# Altium project Kalibracija.PrjPcb
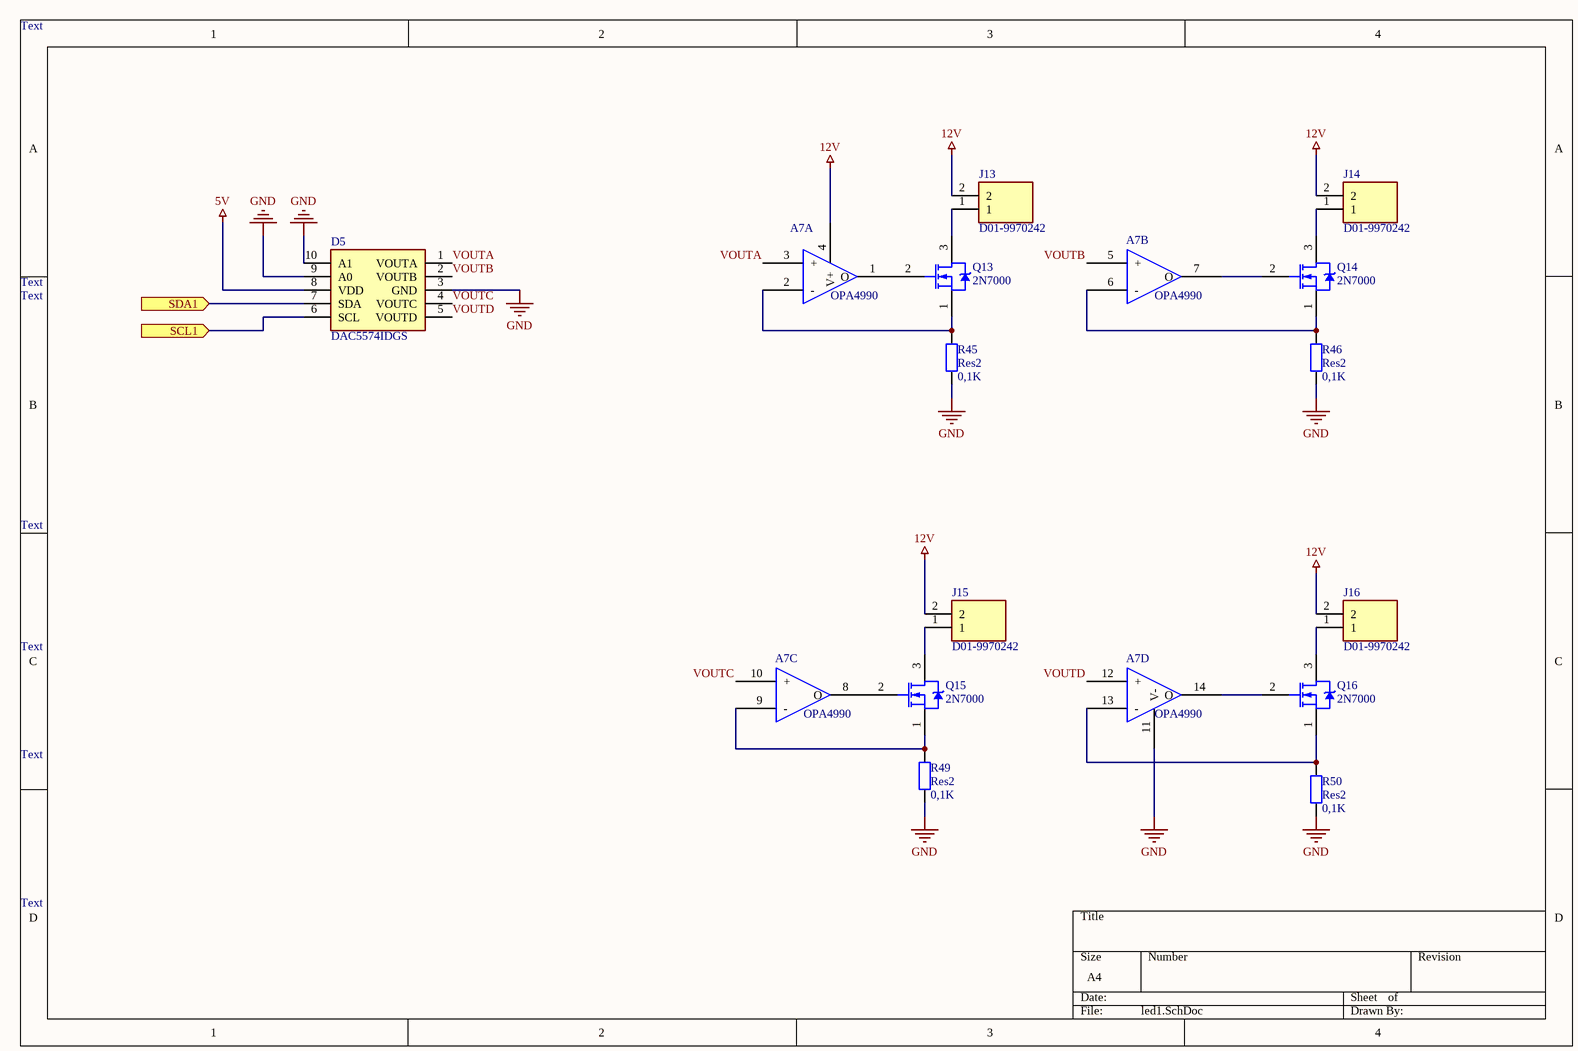
[diagram p0: led1.SchDoc]
8 sheets, 126 parts. Net scope: flat (ports and power ports of the same name join across sheets).
Board file: Plocica_kalibrator.PcbDoc
Sheets:
  led1.SchDoc
  led2.SchDoc
  led3.SchDoc
  led4.SchDoc
  led5.SchDoc
  mikrokontroler.SchDoc
  power.SchDoc
  blokadni_kondenzatori.SchDoc

## Sheet led1.SchDoc
size A4; DocumentNumber: 1; SheetNumber: 1; SheetTotal: 8

### Parts
A7  OPA4990  [SOIC127P600X175-14N]  (parts A,B,C,D of 4)
D5  DAC5574IDGS  [SOP50P490X110-10N]
J13  D01-9970242  [HDR1X2]
J14  D01-9970242  [HDR1X2]
J15  D01-9970242  [HDR1X2]
J16  D01-9970242  [HDR1X2]
Q13  2N7000  [ONSC-TO-92-3-29-11]
Q14  2N7000  [ONSC-TO-92-3-29-11]
Q15  2N7000  [ONSC-TO-92-3-29-11]
Q16  2N7000  [ONSC-TO-92-3-29-11]
R45  Res2  value 0,1K  [C1210]
R46  Res2  value 0,1K  [C1210]
R49  Res2  value 0,1K  [C1210]
R50  Res2  value 0,1K  [C1210]

### Ports
SCL1 (in), SDA1 (in)

### Nets
5V: D5.8(VDD)
12V: A7.4(V+) J13.2 J14.2 J15.2 J16.2
GND: A7.11(V-) D5.3(GND) D5.9(A0) D5.10(A1) R45.1 R46.1 R49.2 R50.2
PB6: D5.6(SCL) ; port SCL1
PB7: D5.7(SDA) ; port SDA1
VOUTA: A7.3(+) D5.1(VOUTA)  [project net VOUTA_1]
VOUTB: A7.5(+) D5.2(VOUTB)  [project net VOUTB_1]
VOUTC: A7.10(+) D5.4(VOUTC)  [project net VOUTC_1]
VOUTD: A7.12(+) D5.5(VOUTD)  [project net VOUTD_1]
NetA7_1: A7.1(O) Q13.2(G)
NetA7_2: A7.2(-) Q13.1(S) R45.2
NetA7_6: A7.6(-) Q14.1(S) R46.2
NetA7_7: A7.7(O) Q14.2(G)
NetA7_8: A7.8(O) Q15.2(G)
NetA7_9: A7.9(-) Q15.1(S) R49.1
NetA7_13: A7.13(-) Q16.1(S) R50.1
NetA7_14: A7.14(O) Q16.2(G)
NetJ13_1: J13.1 Q13.3(D)
NetJ14_1: J14.1 Q14.3(D)
NetJ15_1: J15.1 Q15.3(D)
NetJ16_1: J16.1 Q16.3(D)

### Notes on the sheet
- Text

### Library data of the parts
D5 = DAC5574IDGS: Integrated Circuit; Manufacturer_Name: Texas Instruments; Datasheet Link: http://www.ti.com/lit/gpn/dac5574; Height: 1.1mm; Manufacturer_Part_Number: DAC5574IDGS; Mouser Part Number: 595-DAC5574IDGS; Mouser Price/Stock: https://www.mouser.com/Search/Refine.aspx?Keyword=595-DAC5574IDGS; RS Part Number: 6621533P; RS Price/Stock: http://uk.rs-online.com/web/p/products/6621533P
J13-J16 = D01-9970242: Connector; Manufacturer_Name: HARWIN; Datasheet Link: https://componentsearchengine.com/Datasheets/1/D01-9970242.pdf; Height: 4.25mm; Manufacturer_Part_Number: D01-9970242; Mouser Part Number: 855-D01-9970242; Mouser Price/Stock: https://www.mouser.com/Search/Refine.aspx?Keyword=855-D01-9970242
Q13-Q16 = CMP-1058-00936-1: Small Signal MOSFET, 200 mA, 60 V, N-Channel, 3-Pin TO-92, Bulk Box; Manufacturer: On Semiconductor; Ciss Typ (pF): 60; VGS(th) Max (V): 3; Crss Typ (pF): 5; Channel Polarity: N Channel; VGS Max (V): 20; Configuration: Single; PD Max (W): 0.35; Coss Typ (pF): 25; ID Max (A): 0.2; PackageVersion: Rev. AM; ComponentLink3URL: http://www.onsemi.cn/pub_link/Collateral/2N6426-D.PDF; ComponentLink2URL: http://www.onsemi.com/pub_link/Collateral/2N7000-D.PDF; DatasheetVersion: Rev. 8; Mounting Technology: Through Hole; V(BR)DSS Min (V): 60; PartNumber: 2N7000; PackageDescription: 3-Pin Transistor Outline, Body 4.825 x 3.685 mm, Pitch 1.27 mm; ComponentLink2Description: Datasheet; ComponentLink1URL: http://www.onsemi.com/; PackageReference: TO-92-3-29-11_AM_SL; Packing: Bulk Box; ComponentLink1Description: Manufacturer URL; Package Type: TO-92; ComponentLink3Description: Package Specification
R45 R46 R49 R50 = Res2: Resistor; Published: 8-Jun-2000; LatestRevisionDate: 17-Jul-2002; LatestRevisionNote: Re-released for DXP Platform.; PackageReference: AXIAL-0.4; Publisher: Altium Limited; PackageDescription: Axial Device, Thru-Hole; 2 Leads; 0.4 in Pin Spacing

## Sheet led2.SchDoc
size A4; DocumentNumber: 2; SheetNumber: 2; SheetTotal: 8
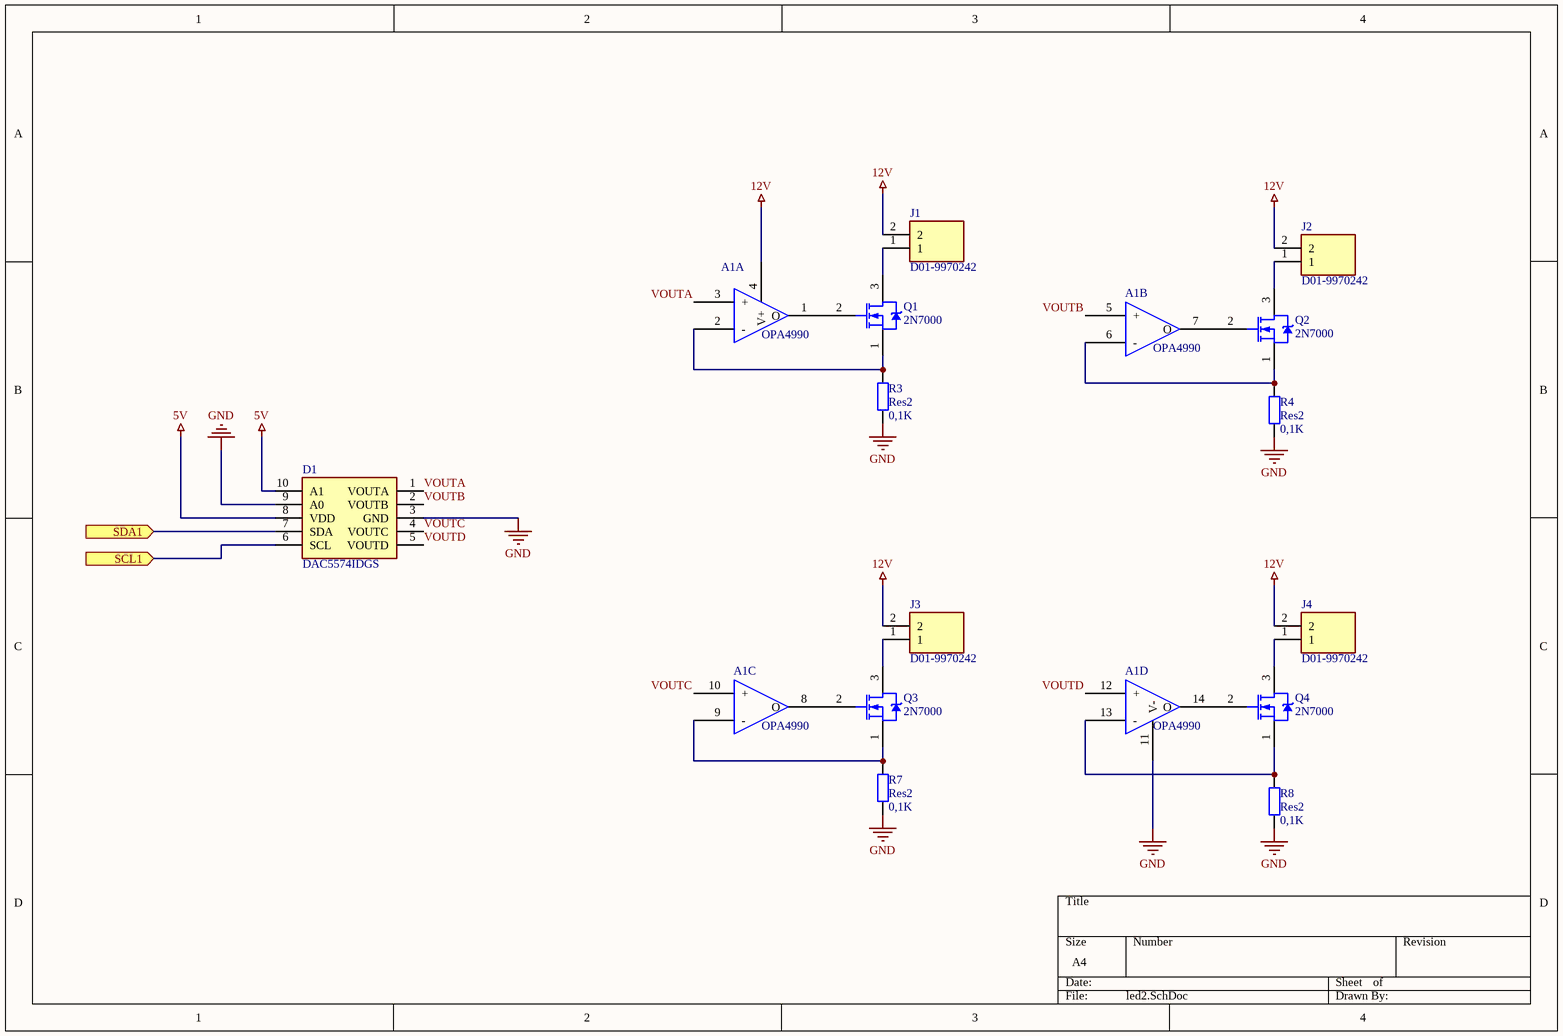
[diagram p1: led2.SchDoc]

### Parts
A1  OPA4990  [SOIC127P600X175-14N]  (parts A,B,C,D of 4)
D1  DAC5574IDGS  [SOP50P490X110-10N]
J1  D01-9970242  [HDR1X2]
J2  D01-9970242  [HDR1X2]
J3  D01-9970242  [HDR1X2]
J4  D01-9970242  [HDR1X2]
Q1  2N7000  [ONSC-TO-92-3-29-11]
Q2  2N7000  [ONSC-TO-92-3-29-11]
Q3  2N7000  [ONSC-TO-92-3-29-11]
Q4  2N7000  [ONSC-TO-92-3-29-11]
R3  Res2  value 0,1K  [C1210]
R4  Res2  value 0,1K  [C1210]
R7  Res2  value 0,1K  [C1210]
R8  Res2  value 0,1K  [C1210]

### Ports
SCL1 (in), SDA1 (in)

### Nets
5V: D1.8(VDD) D1.10(A1)
12V: A1.4(V+) J1.2 J2.2 J3.2 J4.2
GND: A1.11(V-) D1.3(GND) D1.9(A0) R3.1 R4.1 R7.1 R8.1
PB6: D1.6(SCL) ; port SCL1
PB7: D1.7(SDA) ; port SDA1
VOUTA: A1.3(+) D1.1(VOUTA)  [project net VOUTA_2]
VOUTB: A1.5(+) D1.2(VOUTB)  [project net VOUTB_2]
VOUTC: A1.10(+) D1.4(VOUTC)  [project net VOUTC_2]
VOUTD: A1.12(+) D1.5(VOUTD)  [project net VOUTD_2]
NetA1_1: A1.1(O) Q1.2(G)
NetA1_2: A1.2(-) Q1.1(S) R3.2
NetA1_6: A1.6(-) Q2.1(S) R4.2
NetA1_7: A1.7(O) Q2.2(G)
NetA1_8: A1.8(O) Q3.2(G)
NetA1_9: A1.9(-) Q3.1(S) R7.2
NetA1_13: A1.13(-) Q4.1(S) R8.2
NetA1_14: A1.14(O) Q4.2(G)
NetJ1_1: J1.1 Q1.3(D)
NetJ2_1: J2.1 Q2.3(D)
NetJ3_1: J3.1 Q3.3(D)
NetJ4_1: J4.1 Q4.3(D)

### Library data of the parts
D1 = DAC5574IDGS: as D5 on sheet led1; Datasheet Link: http://www.ti.com/lit/gpn/dac5574; Height: 1.1mm; Manufacturer_Part_Number: DAC5574IDGS; Mouser Part Number: 595-DAC5574IDGS; Mouser Price/Stock: https://www.mouser.com/Search/Refine.aspx?Keyword=595-DAC5574IDGS; RS Part Number: 6621533P; RS Price/Stock: http://uk.rs-online.com/web/p/products/6621533P
J1-J4 = D01-9970242: Connector; Manufacturer_Name: HARWIN; Datasheet Link: https://componentsearchengine.com/Datasheets/1/D01-9970242.pdf; Height: 4.25mm; Manufacturer_Part_Number: D01-9970242; Mouser Part Number: 855-D01-9970242; Mouser Price/Stock: https://www.mouser.com/Search/Refine.aspx?Keyword=855-D01-9970242
Q1-Q4 = CMP-1058-00936-1: as Q13 on sheet led1; PackageVersion: Rev. AM; ComponentLink3URL: http://www.onsemi.cn/pub_link/Collateral/2N6426-D.PDF; ComponentLink2URL: http://www.onsemi.com/pub_link/Collateral/2N7000-D.PDF; DatasheetVersion: Rev. 8; Mounting Technology: Through Hole; V(BR)DSS Min (V): 60; PartNumber: 2N7000; PackageDescription: 3-Pin Transistor Outline, Body 4.825 x 3.685 mm, Pitch 1.27 mm; ComponentLink2Description: Datasheet; ComponentLink1URL: http://www.onsemi.com/; PackageReference: TO-92-3-29-11_AM_SL; Packing: Bulk Box; ComponentLink1Description: Manufacturer URL; Package Type: TO-92; ComponentLink3Description: Package Specification
R3 R4 R7 R8 = Res2: Resistor; Published: 8-Jun-2000; LatestRevisionDate: 17-Jul-2002; LatestRevisionNote: Re-released for DXP Platform.; PackageReference: AXIAL-0.4; Publisher: Altium Limited; PackageDescription: Axial Device, Thru-Hole; 2 Leads; 0.4 in Pin Spacing

## Sheet led3.SchDoc
size A4; DocumentNumber: 3; SheetNumber: 3; SheetTotal: 8
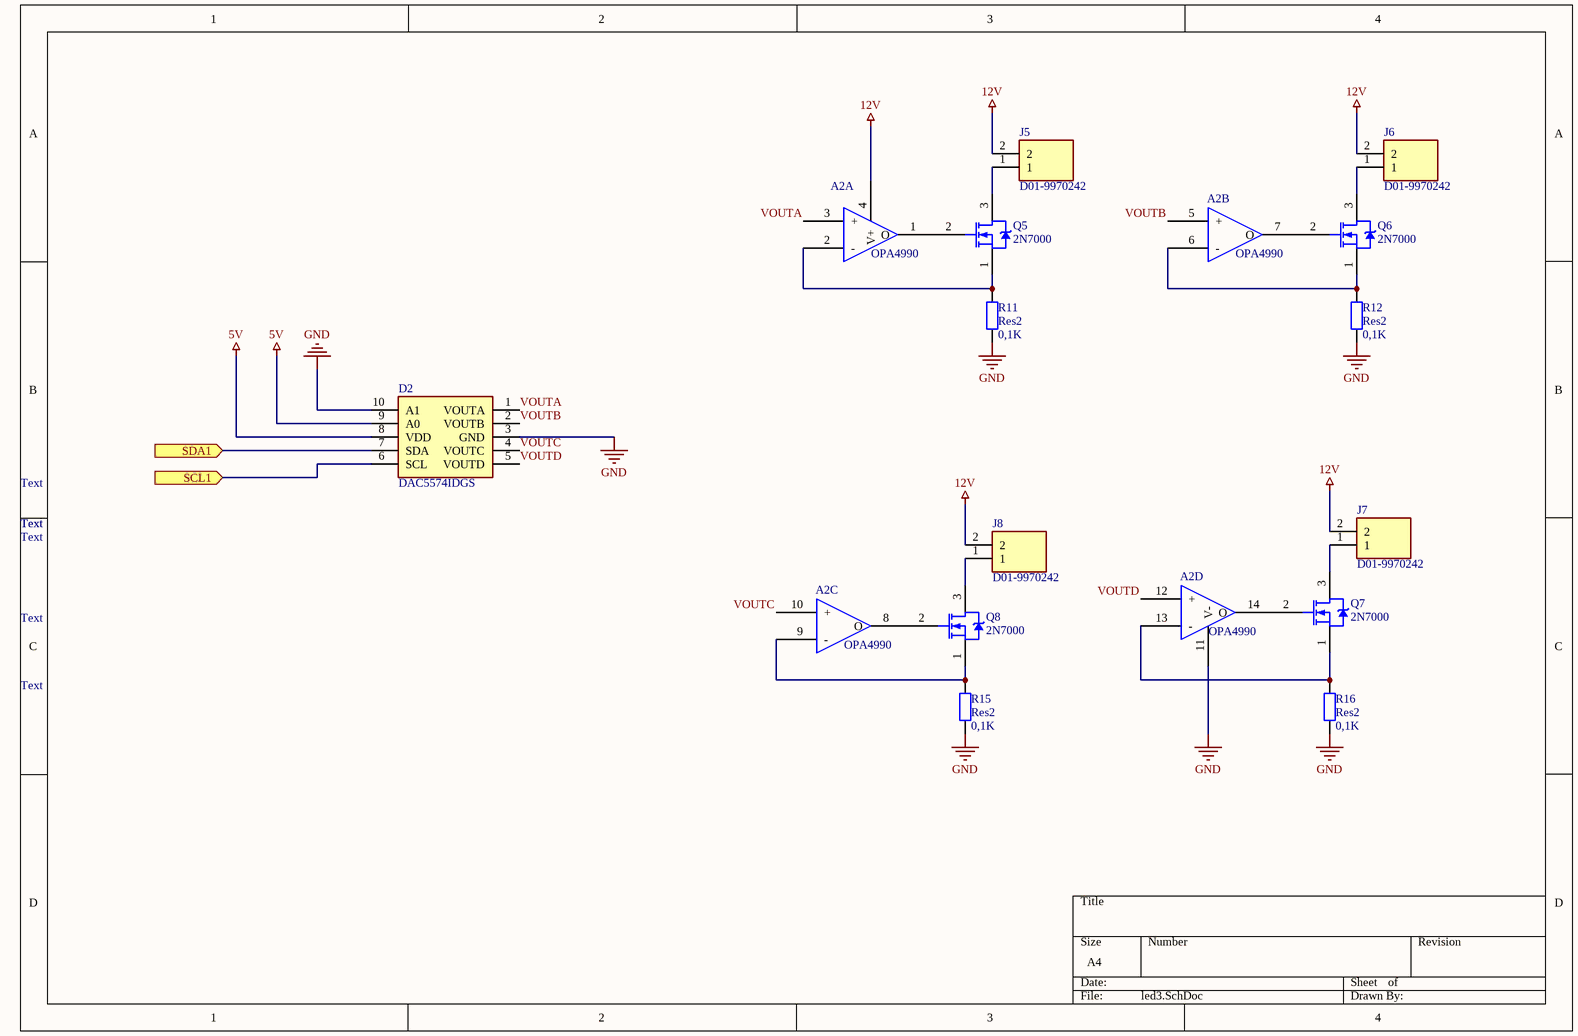
[diagram p2: led3.SchDoc]

### Parts
A2  OPA4990  [SOIC127P600X175-14N]  (parts A,B,C,D of 4)
D2  DAC5574IDGS  [SOP50P490X110-10N]
J5  D01-9970242  [HDR1X2]
J6  D01-9970242  [HDR1X2]
J7  D01-9970242  [HDR1X2]
J8  D01-9970242  [HDR1X2]
Q5  2N7000  [ONSC-TO-92-3-29-11]
Q6  2N7000  [ONSC-TO-92-3-29-11]
Q7  2N7000  [ONSC-TO-92-3-29-11]
Q8  2N7000  [ONSC-TO-92-3-29-11]
R11  Res2  value 0,1K  [C1210]
R12  Res2  value 0,1K  [C1210]
R15  Res2  value 0,1K  [C1210]
R16  Res2  value 0,1K  [C1210]

### Ports
SCL1 (in), SDA1 (in)

### Nets
5V: D2.8(VDD) D2.9(A0)
12V: A2.4(V+) J5.2 J6.2 J7.2 J8.2
GND: A2.11(V-) D2.3(GND) D2.10(A1) R11.1 R12.1 R15.1 R16.1
PB6: D2.6(SCL) ; port SCL1
PB7: D2.7(SDA) ; port SDA1
VOUTA: A2.3(+) D2.1(VOUTA)  [project net VOUTA_3]
VOUTB: A2.5(+) D2.2(VOUTB)  [project net VOUTB_3]
VOUTC: A2.10(+) D2.4(VOUTC)  [project net VOUTC_3]
VOUTD: A2.12(+) D2.5(VOUTD)  [project net VOUTD_3]
NetA2_1: A2.1(O) Q5.2(G)
NetA2_2: A2.2(-) Q5.1(S) R11.2
NetA2_6: A2.6(-) Q6.1(S) R12.2
NetA2_7: A2.7(O) Q6.2(G)
NetA2_8: A2.8(O) Q8.2(G)
NetA2_9: A2.9(-) Q8.1(S) R15.2
NetA2_13: A2.13(-) Q7.1(S) R16.2
NetA2_14: A2.14(O) Q7.2(G)
NetJ5_1: J5.1 Q5.3(D)
NetJ6_1: J6.1 Q6.3(D)
NetJ7_1: J7.1 Q7.3(D)
NetJ8_1: J8.1 Q8.3(D)

### Notes on the sheet
- Text

### Library data of the parts
D2 = DAC5574IDGS: as D5 on sheet led1; Datasheet Link: http://www.ti.com/lit/gpn/dac5574; Height: 1.1mm; Manufacturer_Part_Number: DAC5574IDGS; Mouser Part Number: 595-DAC5574IDGS; Mouser Price/Stock: https://www.mouser.com/Search/Refine.aspx?Keyword=595-DAC5574IDGS; RS Part Number: 6621533P; RS Price/Stock: http://uk.rs-online.com/web/p/products/6621533P
J5-J8 = D01-9970242: Connector; Manufacturer_Name: HARWIN; Datasheet Link: https://componentsearchengine.com/Datasheets/1/D01-9970242.pdf; Height: 4.25mm; Manufacturer_Part_Number: D01-9970242; Mouser Part Number: 855-D01-9970242; Mouser Price/Stock: https://www.mouser.com/Search/Refine.aspx?Keyword=855-D01-9970242
Q5-Q8 = CMP-1058-00936-1: as Q13 on sheet led1; PackageVersion: Rev. AM; ComponentLink3URL: http://www.onsemi.cn/pub_link/Collateral/2N6426-D.PDF; ComponentLink2URL: http://www.onsemi.com/pub_link/Collateral/2N7000-D.PDF; DatasheetVersion: Rev. 8; Mounting Technology: Through Hole; V(BR)DSS Min (V): 60; PartNumber: 2N7000; PackageDescription: 3-Pin Transistor Outline, Body 4.825 x 3.685 mm, Pitch 1.27 mm; ComponentLink2Description: Datasheet; ComponentLink1URL: http://www.onsemi.com/; PackageReference: TO-92-3-29-11_AM_SL; Packing: Bulk Box; ComponentLink1Description: Manufacturer URL; Package Type: TO-92; ComponentLink3Description: Package Specification
R11 R12 R15 R16 = Res2: Resistor; Published: 8-Jun-2000; LatestRevisionDate: 17-Jul-2002; LatestRevisionNote: Re-released for DXP Platform.; PackageReference: AXIAL-0.4; Publisher: Altium Limited; PackageDescription: Axial Device, Thru-Hole; 2 Leads; 0.4 in Pin Spacing

## Sheet led4.SchDoc
size A4; DocumentNumber: 4; SheetNumber: 4; SheetTotal: 8
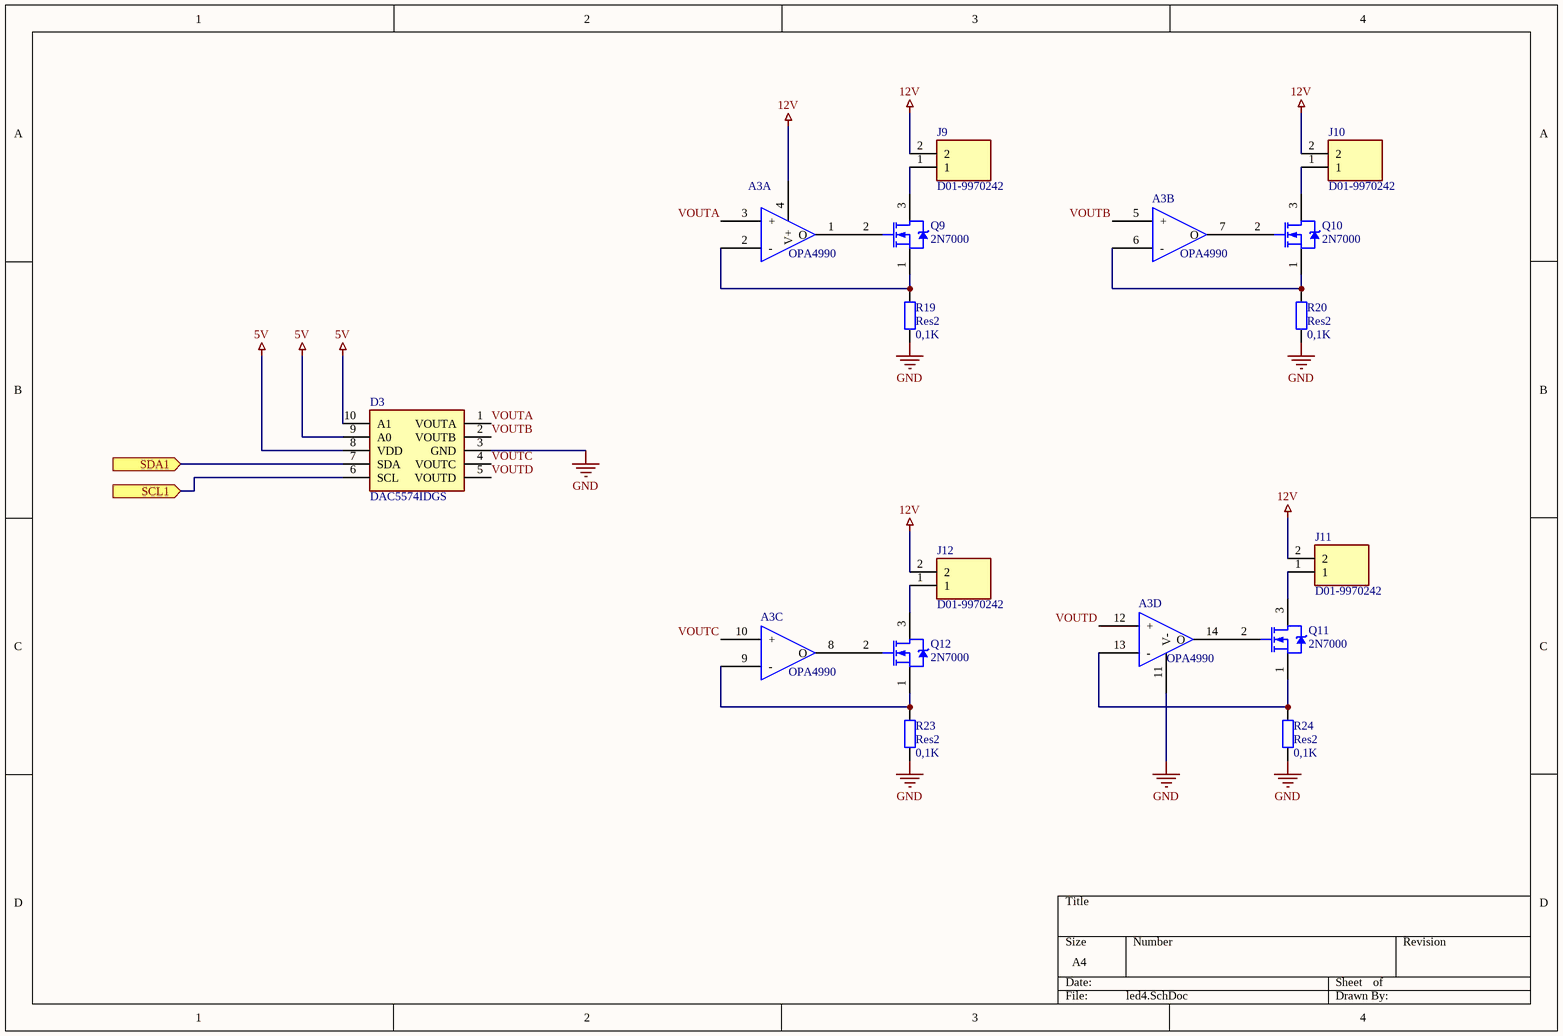
[diagram p3: led4.SchDoc]

### Parts
A3  OPA4990  [SOIC127P600X175-14N]  (parts A,B,C,D of 4)
D3  DAC5574IDGS  [SOP50P490X110-10N]
J9  D01-9970242  [HDR1X2]
J10  D01-9970242  [HDR1X2]
J11  D01-9970242  [HDR1X2]
J12  D01-9970242  [HDR1X2]
Q9  2N7000  [ONSC-TO-92-3-29-11]
Q10  2N7000  [ONSC-TO-92-3-29-11]
Q11  2N7000  [ONSC-TO-92-3-29-11]
Q12  2N7000  [ONSC-TO-92-3-29-11]
R19  Res2  value 0,1K  [C1210]
R20  Res2  value 0,1K  [C1210]
R23  Res2  value 0,1K  [C1210]
R24  Res2  value 0,1K  [C1210]

### Ports
SCL1 (in), SDA1 (in)

### Nets
5V: D3.8(VDD) D3.9(A0) D3.10(A1)
12V: A3.4(V+) J9.2 J10.2 J11.2 J12.2
GND: A3.11(V-) D3.3(GND) R19.1 R20.1 R23.1 R24.1
PB6: D3.6(SCL) ; port SCL1
PB7: D3.7(SDA) ; port SDA1
VOUTA: A3.3(+) D3.1(VOUTA)  [project net VOUTA_4]
VOUTB: A3.5(+) D3.2(VOUTB)  [project net VOUTB_4]
VOUTC: A3.10(+) D3.4(VOUTC)  [project net VOUTC_4]
VOUTD: A3.12(+) D3.5(VOUTD)  [project net VOUTD_4]
NetA3_1: A3.1(O) Q9.2(G)
NetA3_2: A3.2(-) Q9.1(S) R19.2
NetA3_6: A3.6(-) Q10.1(S) R20.2
NetA3_7: A3.7(O) Q10.2(G)
NetA3_8: A3.8(O) Q12.2(G)
NetA3_9: A3.9(-) Q12.1(S) R23.2
NetA3_13: A3.13(-) Q11.1(S) R24.2
NetA3_14: A3.14(O) Q11.2(G)
NetJ9_1: J9.1 Q9.3(D)
NetJ10_1: J10.1 Q10.3(D)
NetJ11_1: J11.1 Q11.3(D)
NetJ12_1: J12.1 Q12.3(D)

### Library data of the parts
D3 = DAC5574IDGS: as D5 on sheet led1; Datasheet Link: http://www.ti.com/lit/gpn/dac5574; Height: 1.1mm; Manufacturer_Part_Number: DAC5574IDGS; Mouser Part Number: 595-DAC5574IDGS; Mouser Price/Stock: https://www.mouser.com/Search/Refine.aspx?Keyword=595-DAC5574IDGS; RS Part Number: 6621533P; RS Price/Stock: http://uk.rs-online.com/web/p/products/6621533P
J9-J12 = D01-9970242: Connector; Manufacturer_Name: HARWIN; Datasheet Link: https://componentsearchengine.com/Datasheets/1/D01-9970242.pdf; Height: 4.25mm; Manufacturer_Part_Number: D01-9970242; Mouser Part Number: 855-D01-9970242; Mouser Price/Stock: https://www.mouser.com/Search/Refine.aspx?Keyword=855-D01-9970242
Q9-Q12 = CMP-1058-00936-1: as Q13 on sheet led1; PackageVersion: Rev. AM; ComponentLink3URL: http://www.onsemi.cn/pub_link/Collateral/2N6426-D.PDF; ComponentLink2URL: http://www.onsemi.com/pub_link/Collateral/2N7000-D.PDF; DatasheetVersion: Rev. 8; Mounting Technology: Through Hole; V(BR)DSS Min (V): 60; PartNumber: 2N7000; PackageDescription: 3-Pin Transistor Outline, Body 4.825 x 3.685 mm, Pitch 1.27 mm; ComponentLink2Description: Datasheet; ComponentLink1URL: http://www.onsemi.com/; PackageReference: TO-92-3-29-11_AM_SL; Packing: Bulk Box; ComponentLink1Description: Manufacturer URL; Package Type: TO-92; ComponentLink3Description: Package Specification
R19 R20 R23 R24 = Res2: Resistor; Published: 8-Jun-2000; LatestRevisionDate: 17-Jul-2002; LatestRevisionNote: Re-released for DXP Platform.; PackageReference: AXIAL-0.4; Publisher: Altium Limited; PackageDescription: Axial Device, Thru-Hole; 2 Leads; 0.4 in Pin Spacing

## Sheet led5.SchDoc
size A4; DocumentNumber: 5; SheetNumber: 5; SheetTotal: 8
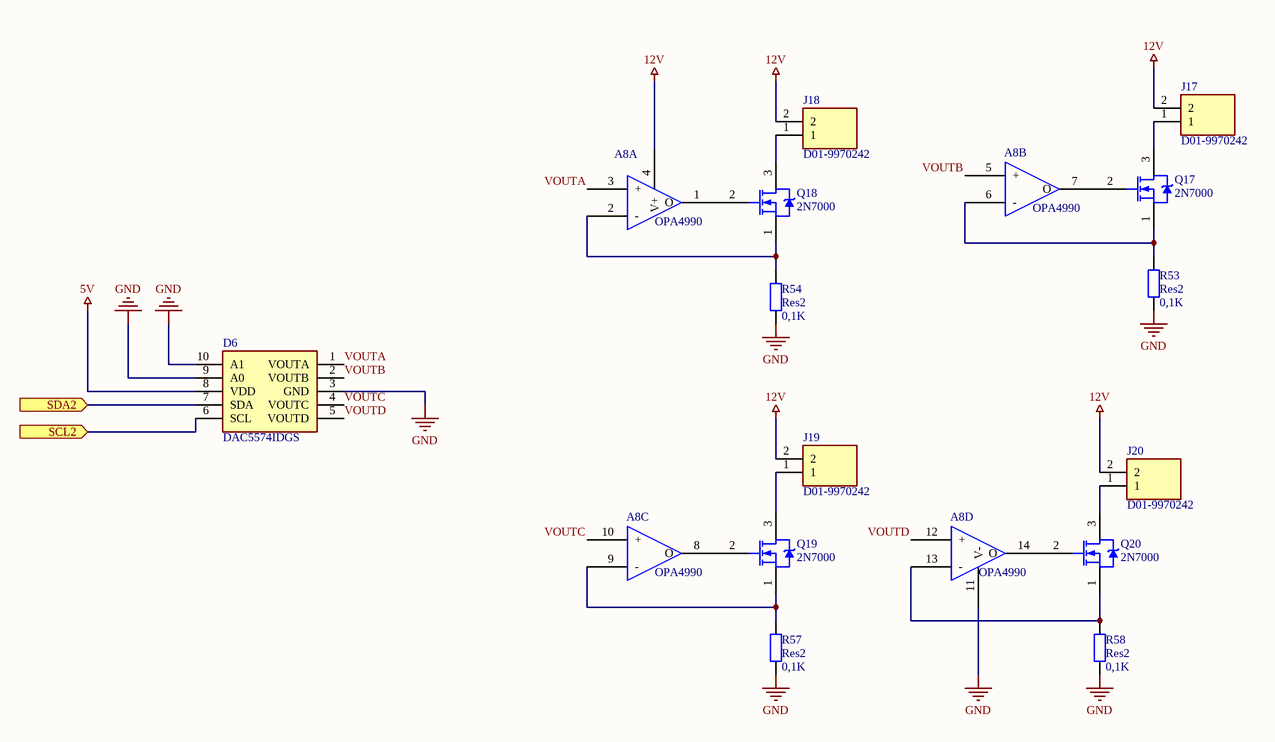
[diagram p4: led5.SchDoc]

### Parts
A8  OPA4990  [SOIC127P600X175-14N]  (parts A,B,C,D of 4)
D6  DAC5574IDGS  [SOP50P490X110-10N]
J17  D01-9970242  [HDR1X2]
J18  D01-9970242  [HDR1X2]
J19  D01-9970242  [HDR1X2]
J20  D01-9970242  [HDR1X2]
Q17  2N7000  [ONSC-TO-92-3-29-11]
Q18  2N7000  [ONSC-TO-92-3-29-11]
Q19  2N7000  [ONSC-TO-92-3-29-11]
Q20  2N7000  [ONSC-TO-92-3-29-11]
R53  Res2  value 0,1K  [C1210]
R54  Res2  value 0,1K  [C1210]
R57  Res2  value 0,1K  [C1210]
R58  Res2  value 0,1K  [C1210]

### Ports
SCL2 (in), SDA2 (in)

### Nets
5V: D6.8(VDD)
12V: A8.4(V+) J17.2 J18.2 J19.2 J20.2
GND: A8.11(V-) D6.3(GND) D6.9(A0) D6.10(A1) R53.1 R54.1 R57.1 R58.1
PB8: D6.6(SCL) ; port SCL2
PB9: D6.7(SDA) ; port SDA2
VOUTA: A8.3(+) D6.1(VOUTA)  [project net VOUTA_5]
VOUTB: A8.5(+) D6.2(VOUTB)  [project net VOUTB_5]
VOUTC: A8.10(+) D6.4(VOUTC)  [project net VOUTC_5]
VOUTD: A8.12(+) D6.5(VOUTD)  [project net VOUTD_5]
NetA8_1: A8.1(O) Q18.2(G)
NetA8_2: A8.2(-) Q18.1(S) R54.2
NetA8_6: A8.6(-) Q17.1(S) R53.2
NetA8_7: A8.7(O) Q17.2(G)
NetA8_8: A8.8(O) Q19.2(G)
NetA8_9: A8.9(-) Q19.1(S) R57.2
NetA8_13: A8.13(-) Q20.1(S) R58.2
NetA8_14: A8.14(O) Q20.2(G)
NetJ17_1: J17.1 Q17.3(D)
NetJ18_1: J18.1 Q18.3(D)
NetJ19_1: J19.1 Q19.3(D)
NetJ20_1: J20.1 Q20.3(D)

### Library data of the parts
D6 = DAC5574IDGS: as D5 on sheet led1; Datasheet Link: http://www.ti.com/lit/gpn/dac5574; Height: 1.1mm; Manufacturer_Part_Number: DAC5574IDGS; Mouser Part Number: 595-DAC5574IDGS; Mouser Price/Stock: https://www.mouser.com/Search/Refine.aspx?Keyword=595-DAC5574IDGS; RS Part Number: 6621533P; RS Price/Stock: http://uk.rs-online.com/web/p/products/6621533P
J17-J20 = D01-9970242: Connector; Manufacturer_Name: HARWIN; Datasheet Link: https://componentsearchengine.com/Datasheets/1/D01-9970242.pdf; Height: 4.25mm; Manufacturer_Part_Number: D01-9970242; Mouser Part Number: 855-D01-9970242; Mouser Price/Stock: https://www.mouser.com/Search/Refine.aspx?Keyword=855-D01-9970242
Q17-Q20 = CMP-1058-00936-1: as Q13 on sheet led1; PackageVersion: Rev. AM; ComponentLink3URL: http://www.onsemi.cn/pub_link/Collateral/2N6426-D.PDF; ComponentLink2URL: http://www.onsemi.com/pub_link/Collateral/2N7000-D.PDF; DatasheetVersion: Rev. 8; Mounting Technology: Through Hole; V(BR)DSS Min (V): 60; PartNumber: 2N7000; PackageDescription: 3-Pin Transistor Outline, Body 4.825 x 3.685 mm, Pitch 1.27 mm; ComponentLink2Description: Datasheet; ComponentLink1URL: http://www.onsemi.com/; PackageReference: TO-92-3-29-11_AM_SL; Packing: Bulk Box; ComponentLink1Description: Manufacturer URL; Package Type: TO-92; ComponentLink3Description: Package Specification
R53 R54 R57 R58 = Res2: Resistor; Published: 8-Jun-2000; LatestRevisionDate: 17-Jul-2002; LatestRevisionNote: Re-released for DXP Platform.; PackageReference: AXIAL-0.4; Publisher: Altium Limited; PackageDescription: Axial Device, Thru-Hole; 2 Leads; 0.4 in Pin Spacing

## Sheet mikrokontroler.SchDoc
size A4; DocumentNumber: 6; SheetNumber: 6; SheetTotal: 8
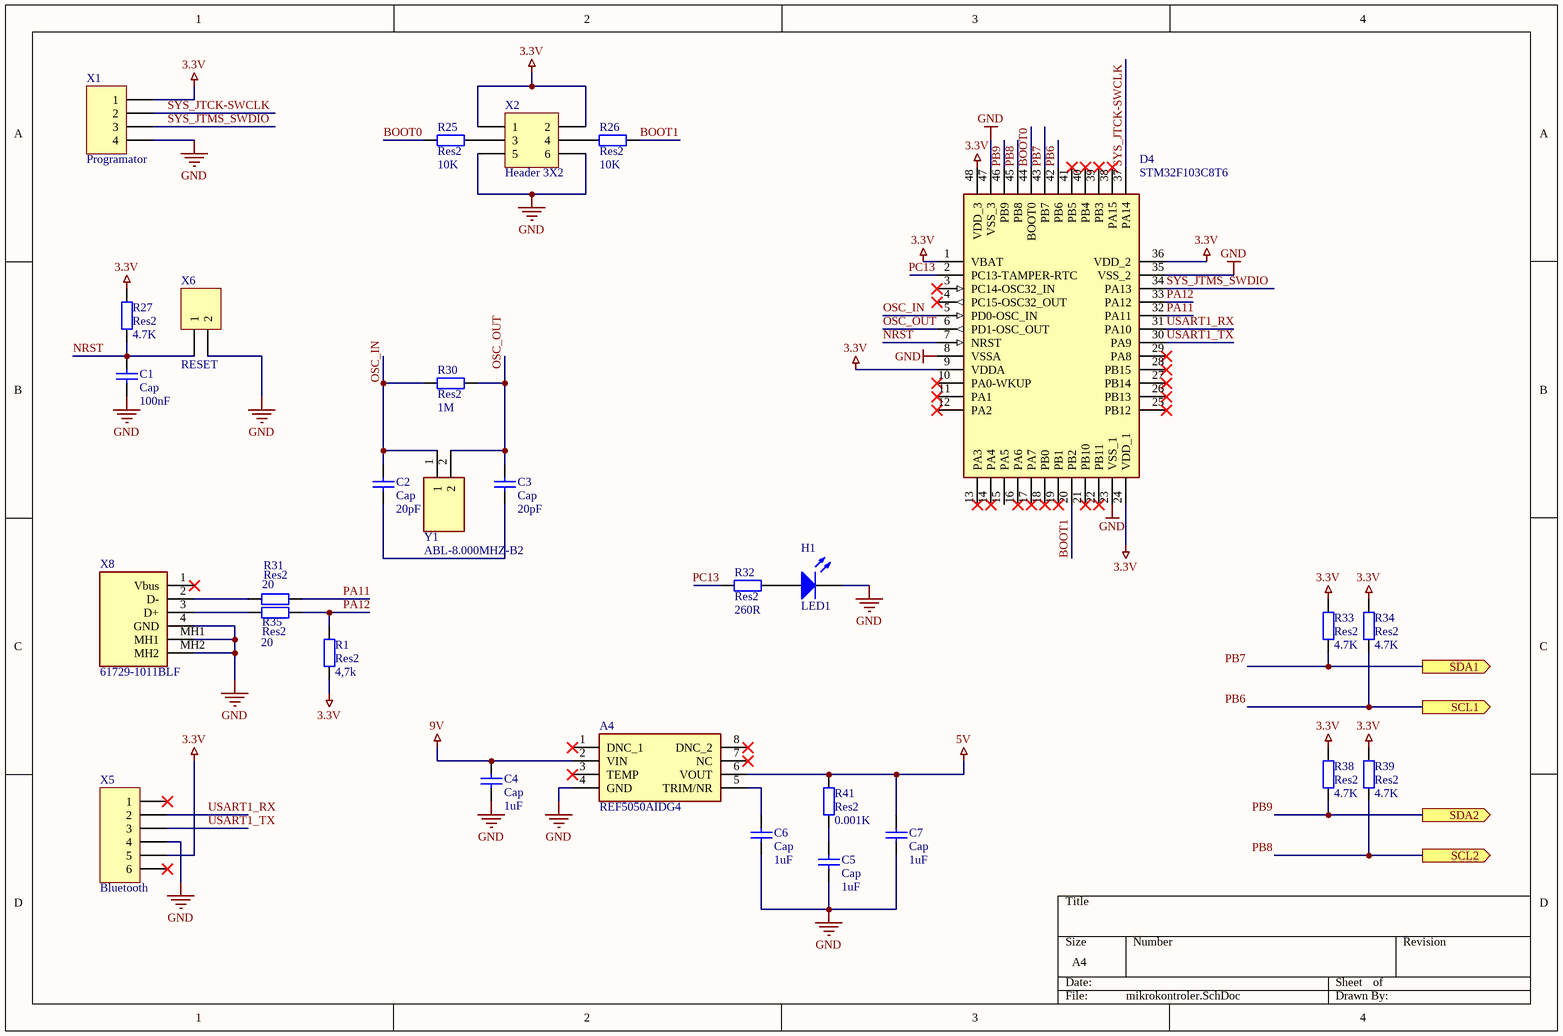
[diagram p5: mikrokontroler.SchDoc]

### Parts
A4  REF5050AIDG4  [SOIC127P600X175-8N]
C1  Cap  value 100nF  [6-0805_L]
C2  Cap  value 20pF  [6-0805_L]
C3  Cap  value 20pF  [6-0805_L]
C4  Cap  value 1uF  [6-0805_L]
C5  Cap  value 1uF  [6-0805_L]
C6  Cap  value 1uF  [6-0805_L]
C7  Cap  value 1uF  [6-0805_L]
D4  STM32F103C8T6  [QFP50P900X900X160-48N]
H1  LED1  [LED-1]
R1  Res2  value 4,7k  [6-0805_L]
R25  Res2  value 10K  [6-0805_L]
R26  Res2  value 10K  [6-0805_L]
R27  Res2  value 4.7K  [6-0805_L]
R30  Res2  value 1M  [6-0805_L]
R31  Res2  value 20  [6-0805_L]
R32  Res2  value 260R  [6-0805_L]
R33  Res2  value 4.7K  [6-0805_L]
R34  Res2  value 4.7K  [6-0805_L]
R35  Res2  value 20  [6-0805_L]
R38  Res2  value 4.7K  [6-0805_L]
R39  Res2  value 4.7K  [6-0805_L]
R41  Res2  value 0.001K  [6-0805_L]
X1  Programator  [HDR1X4]
X2  Header 3X2  [HDR2X3]
X5  Bluetooth  [HDR1X6]
X6  RESET  [HDR1X2]
X8  61729-1011BLF  [617291011BLF]
Y1  ABL-8.000MHZ-B2  [HC/49US_(AT49)PTH]

### Ports
SCL1 (out), SCL2 (out), SDA1 (out), SDA2 (out)

### Nets
3.3V: D4.1(VBAT) D4.9(VDDA) D4.24(VDD_1) D4.36(VDD_2) D4.48(VDD_3) R1.2 R27.2 R33.2 R34.2 R38.2 R39.2 X1.1 X2.1 X2.2 X5.5
5V: A4.6(VOUT) C7.2 R41.1
9V: A4.2(VIN) C4.2
GND: A4.4(GND) C1.1 C4.1 C5.1 C6.1 C7.1 D4.8(VSSA) D4.23(VSS_1) D4.35(VSS_2) D4.47(VSS_3) H1.2(K) X1.4 X2.5 X2.6 X5.4 X6.2 X8.4(GND) X8.MH1 X8.MH2
BOOT0: D4.44(BOOT0) R25.2  [project net BOOT0_6]
BOOT1: D4.20(PB2) R26.1  [project net BOOT1_6]
NRST: C1.2 D4.7(NRST) R27.1 X6.1  [project net NRST_6]
OSC_IN: C2.2 D4.5(PD0-OSC_IN) R30.2 Y1.1  [project net OSC_IN_6]
OSC_OUT: C3.2 D4.6(PD1-OSC_OUT) R30.1 Y1.2  [project net OSC_OUT_6]
PA11: D4.32(PA11) R31.1  [project net PA11_6]
PA12: D4.33(PA12) R1.1 R35.1  [project net PA12_6]
PB6: D4.42(PB6) R34.1 ; port SCL1
PB7: D4.43(PB7) R33.1 ; port SDA1
PB8: D4.45(PB8) R39.1 ; port SCL2
PB9: D4.46(PB9) R38.1 ; port SDA2
PC13: D4.2(PC13-TAMPER-RTC) R32.1  [project net PC13_6]
SYS_JTCK-SWCLK: D4.37(PA14) X1.2  [project net SYS_JTCK-SWCLK_6]
SYS_JTMS_SWDIO: D4.34(PA13) X1.3  [project net SYS_JTMS_SWDIO_6]
USART1_RX: D4.31(PA10) X5.2  [project net USART1_RX_6]
USART1_TX: D4.30(PA9) X5.3  [project net USART1_TX_6]
NetA4_5: A4.5(TRIM/NR) C6.2
NetC2_1: C2.1 C3.1
NetC5_2: C5.2 R41.2
NetH1_1: H1.1(A) R32.2
NetR25_1: R25.1 X2.3
NetR26_2: R26.2 X2.4
NetR31_2: R31.2 X8.2(D-)
NetR35_2: R35.2 X8.3(D+)

Not connected (* = marked no-connect by the designer): A4 1(DNC_1)* 3(TEMP)* 7(NC)* 8(DNC_2)*; D4 3(PC14-OSC32_IN)* 4(PC15-OSC32_OUT)* 10(PA0-WKUP)* 11(PA1)* 12(PA2)* 13(PA3)* 14(PA4)* 15(PA5) 16(PA6)* 17(PA7)* 18(PB0)* 19(PB1)* 21(PB10)* 22(PB11)* 25(PB12)* 26(PB13)* 27(PB14)* 28(PB15)* 29(PA8)* 38(PA15)* 39(PB3)* 40(PB4)* 41(PB5)*; X5 1* 6*; X8 1(Vbus)*

### Library data of the parts
A4 = REF5050AIDG4: Integrated Circuit; Manufacturer_Name: Texas Instruments; Datasheet Link: http://www.ti.com/lit/ds/symlink/ref5050.pdf; Height: 1.75mm; Manufacturer_Part_Number: REF5050AIDG4; Mouser Part Number: 595-REF5050AIDG4; Mouser Price/Stock: https://www.mouser.com/Search/Refine.aspx?Keyword=595-REF5050AIDG4
C1-C7 = Cap: Capacitor; Published: 8-Jun-2000; LatestRevisionDate: 17-Jul-2002; LatestRevisionNote: Re-released for DXP Platform.; PackageReference: RAD-0.3; Publisher: Altium Limited; PackageDescription: Radial Cap, Thru-Hole; 2 Leads; 0.3 in Pin Spacing
D4 = STM32F103C8T6: Integrated Circuit; Manufacturer_Name: STMicroelectronics; Allied_Number: 70390993; Datasheet Link: http://www.st.com/st-web-ui/static/active/en/resource/technical/document/datasheet/CD00161566.pdf; Height: 1.6mm; Manufacturer_Part_Number: STM32F103C8T6; Mouser Part Number: 511-STM32F103C8T6; Mouser Price/Stock: https://www.mouser.com/Search/Refine.aspx?Keyword=511-STM32F103C8T6; RS Part Number: 0402279P; RS Price/Stock: http://uk.rs-online.com/web/p/products/0402279P; Allied Price/Stock: http://www.alliedelec.com/stmicroelectronics-stm32f103c8t6/70390993/
H1 = LED1: Typical RED GaAs LED; Published: 8-Jun-2000; LatestRevisionDate: 08-Jul-2005; LatestRevisionNote: Mech Layer 1 removed.; PackageReference: LED-1; Publisher: Altium Limited; PackageDescription: LED; 2 Leads
R1 R25-R27 R30-R35 R38 R39 R41 = Res2: Resistor; Published: 8-Jun-2000; LatestRevisionDate: 17-Jul-2002; LatestRevisionNote: Re-released for DXP Platform.; PackageReference: AXIAL-0.4; Publisher: Altium Limited; PackageDescription: Axial Device, Thru-Hole; 2 Leads; 0.4 in Pin Spacing
X1 = Header 4: Header, 4-Pin; LatestRevisionDate: 17-Jul-2002; LatestRevisionNote: Re-released for DXP Platform.; Publisher: Altium Limited
X2 = Header 3X2: Header, 3-Pin, Dual row; LatestRevisionDate: 17-Jul-2002; LatestRevisionNote: Re-released for DXP Platform.; Publisher: Altium Limited
X5 = Header 6: Header, 6-Pin; LatestRevisionDate: 17-Jul-2002; LatestRevisionNote: Re-released for DXP Platform.; Publisher: Altium Limited
X6 = Header 2: Header, 2-Pin; LatestRevisionDate: 17-Jul-2002; LatestRevisionNote: Re-released for DXP Platform.; Publisher: Altium Limited
X8 = 61729-1011BLF: Connector; Manufacturer_Name: Amphenol; Allied_Number: 70236839; Datasheet Link: https://www.mouser.com/datasheet/2/18/61729-1363119.pdf; Height: 11.5mm; Manufacturer_Part_Number: 61729-1011BLF; Mouser Part Number: 649-61729-1011BLF; Mouser Price/Stock: https://www.mouser.com/Search/Refine.aspx?Keyword=649-61729-1011BLF; RS Part Number: 7710041; RS Price/Stock: http://uk.rs-online.com/web/p/products/7710041; Allied Price/Stock: https://www.alliedelec.com/amphenol-fci-61729-1011blf/70236839/
Y1 = ABL-8.000MHZ-B2: Crystal or Oscillator; Manufacturer_Name: ABRACON; Datasheet Link: http://www.abracon.com/Resonators/ABL.pdf; Manufacturer_Part_Number: ABL-8.000MHZ-B2; Mouser Part Number: 815-ABL-8-B2; Mouser Price/Stock: https://www.mouser.co.uk/ProductDetail/ABRACON/ABL-8000MHZ-B2?qs=zLkLEWnxMJxHYmzIauBRTw%3D%3D; RS Part Number: 1710614; RS Price/Stock: http://uk.rs-online.com/web/p/products/1710614

## Sheet power.SchDoc
size A4; DocumentNumber: 7; SheetNumber: 7; SheetTotal: 8
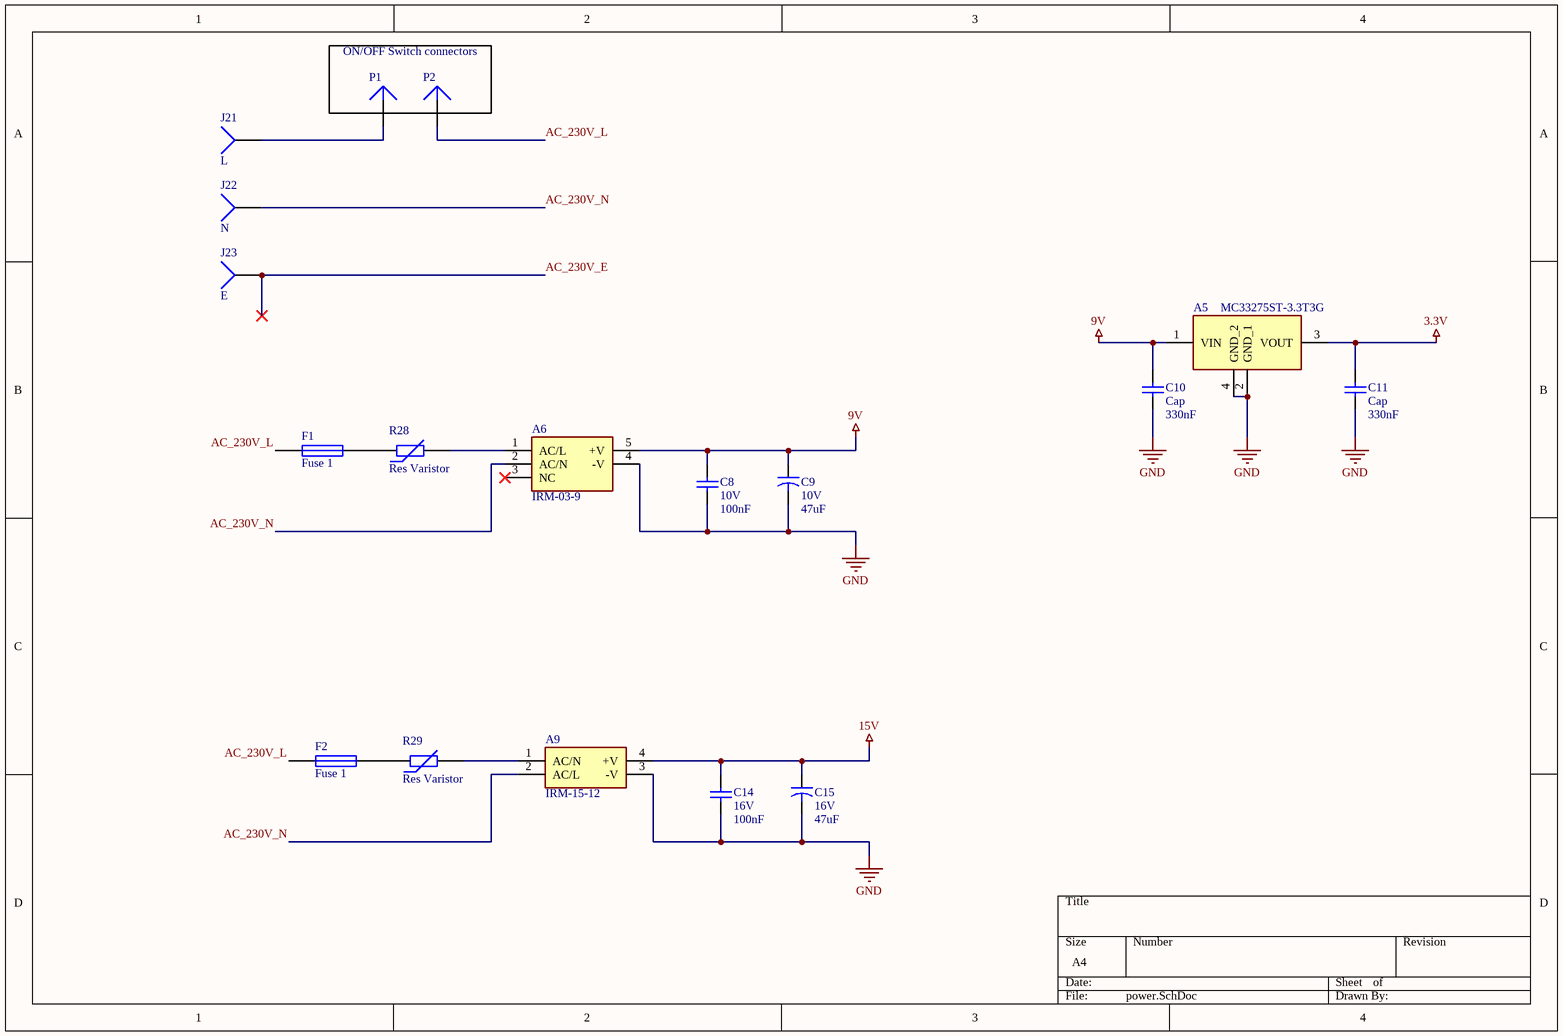
[diagram p6: power.SchDoc]

### Parts
A5  MC33275ST-3.3T3G  [SOT230P700X175-4N]
A6  IRM-03-9  [IRM039]
A9  IRM-15-12  [IRM-15-12]
C8  10V  value 100nF  [6-0805_L]
C9  10V  value 47uF  [CAPAE830X1050N]
C10  Cap  value 330nF  [6-0805_L]
C11  Cap  value 330nF  [6-0805_L]
C14  16V  value 100nF  [6-0805_L]
C15  16V  value 47uF  [CAPAE830X1050N]
F1  Fuse 1  [0751.0056]
F2  Fuse 1  [0751.0056]
J21  L  [PIN1]
J22  N  [PIN1]
J23  E  [PIN1]
P1  Plug  [PIN1]  (value not drawn)
P2  Plug  [PIN1]  (value not drawn)
R28  Res Varistor  [CAPR5-4X5]
R29  Res Varistor  [CAPR5-4X5]

### Blocks framed on the sheet
ON/OFF Switch connectors: P1 P2

### Nets
3.3V: A5.3(VOUT) C11.2
9V: A5.1(VIN) A6.5(+V) C8.2 C9.1 C10.2
15V: A9.4(+V) C14.2 C15.1
GND: A5.2(GND_1) A5.4(GND_2) A6.4(-V) A9.3(-V) C8.1 C9.2 C10.1 C11.1 C14.1 C15.2
AC_230V_E: J23.1  [project net AC_230V_E_7]
AC_230V_L: F1.1 F2.1 P2.1  [project net AC_230V_L_7]
AC_230V_N: A6.2(AC/N) A9.2(AC/L) J22.1  [project net AC_230V_N_7]
NetA6_1: A6.1(AC/L) R28.2
NetA9_1: A9.1(AC/N) R29.2
NetF1_2: F1.2 R28.1
NetF2_2: F2.2 R29.1
NetJ21_1: J21.1 P1.1

Not connected (* = marked no-connect by the designer): A6 3(NC)*

### Library data of the parts
A5 = MC33275ST-3.3T3G: Integrated Circuit; Manufacturer_Name: ON Semiconductor; Allied_Number: 70340056; Datasheet Link: http://www.onsemi.com/pub/Collateral/MC33275-D.PDF; Height: 1.75mm; Manufacturer_Part_Number: MC33275ST-3.3T3G; Mouser Part Number: 863-MC33275ST-3.3T3G; Mouser Price/Stock: https://www.mouser.com/Search/Refine.aspx?Keyword=863-MC33275ST-3.3T3G; RS Part Number: 7856910P; RS Price/Stock: http://uk.rs-online.com/web/p/products/7856910P; Allied Price/Stock: https://www.alliedelec.com/on-semiconductor-mc33275st-3-3t3g/70340056/
A6 = IRM-03-9: Power Supply; Manufacturer_Name: Mean Well; Allied_Number: 70879802; Datasheet Link: https://componentsearchengine.com/Datasheets/2/IRM-03-9.pdf; Height: 15mm; Manufacturer_Part_Number: IRM-03-9; Mouser Part Number: 709-IRM03-9; Mouser Price/Stock: https://www.mouser.com/Search/Refine.aspx?Keyword=709-IRM03-9; RS Part Number: 1359235P; RS Price/Stock: http://uk.rs-online.com/web/p/products/1359235P; Allied Price/Stock: https://www.alliedelec.com/meanwellusa-irm-03-9/70879802/
A9 = IRM-15-12: Power Supply; Manufacturer_Name: Mean Well; Datasheet Link: https://www.meanwell-web.com/content/files/pdfs/productPdfs/MW/IRM-15-spec.pdf; Mouser2 Part Number: 709-IRM15-12; Mouser2 Price/Stock: https://www.mouser.com/Search/Refine.aspx?Keyword=709-IRM15-12; Manufacturer_Part_Number: IRM-15-12
C8 C10 C11 C14 = Cap: Capacitor; Published: 8-Jun-2000; LatestRevisionDate: 17-Jul-2002; LatestRevisionNote: Re-released for DXP Platform.; PackageReference: RAD-0.3; Publisher: Altium Limited; PackageDescription: Radial Cap, Thru-Hole; 2 Leads; 0.3 in Pin Spacing
C9 C15 = Cap2: Capacitor; Published: 23-Sep-2002; PackageReference: CAPR5-4X5; Publisher: Altium Limited; PackageDescription: Capacitor; 2 Leads
F1 F2 = Fuse 1: Fuse; Published: 8-Jun-2000; LatestRevisionDate: 17-Jul-2002; LatestRevisionNote: Re-released for DXP Platform.; PackageReference: PIN-W2/E2.8; Publisher: Altium Limited; PackageDescription: Thru-Hole; 2 Leads
J21-J23 = Socket: LatestRevisionDate: 17-Jul-2002; LatestRevisionNote: Re-released for DXP Platform.; Publisher: Altium Limited
R28 R29 = Res Varistor: Varistor (Voltage-Sensitive Resistor); Published: 24-Mar-1999; LatestRevisionDate: 29-May-2009; LatestRevisionNote: IPC-7351 Footprint Added.; PackageVersion: Mar-2003; PackageReference: 6-0805; Publisher: Altium Limited; PackageDescription: Chip Resistor 0805 Case Size; Code_IPC: RESC2012
P1 P2 = Plug: LatestRevisionDate: 17-Jul-2002; LatestRevisionNote: Re-released for DXP Platform.; Publisher: Altium Limited

## Sheet blokadni_kondenzatori.SchDoc
size A4; DocumentNumber: 8; SheetNumber: 8; SheetTotal: 8
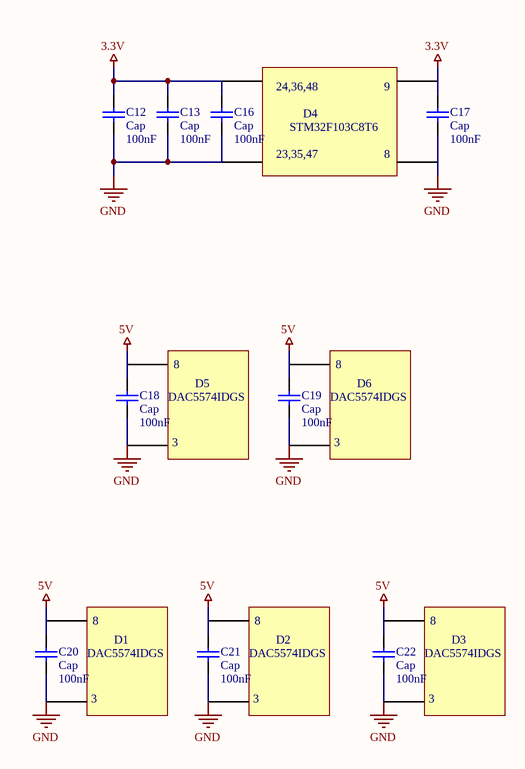
[diagram p7: blokadni_kondenzatori.SchDoc]

### Parts
C12  Cap  value 100nF  [6-0805_L]
C13  Cap  value 100nF  [6-0805_L]
C16  Cap  value 100nF  [6-0805_L]
C17  Cap  value 100nF  [6-0805_L]
C18  Cap  value 100nF  [6-0805_L]
C19  Cap  value 100nF  [6-0805_L]
C20  Cap  value 100nF  [6-0805_L]
C21  Cap  value 100nF  [6-0805_L]
C22  Cap  value 100nF  [6-0805_L]

### Nets
3.3V: C12.2 C13.2 C16.2 C17.2
5V: C18.2 C19.2 C20.2 C21.2 C22.2
GND: C12.1 C13.1 C16.1 C17.1 C18.1 C19.1 C20.1 C21.1 C22.1

### Notes on the sheet
- 24,36,48
- (near C17) 9
- 23,35,47
- STM32F103C8T6
- D4
- 8
- DAC5574IDGS
- (near C18) 8
- D5
- (near C19) DAC5574IDGS
- (near C19) 8
- D6
- 3
- (near C20) 8
- (near C21) 8
- (near C22) 8
- D1
- (near C21) DAC5574IDGS
- D2
- (near C22) DAC5574IDGS
- D3

### Library data of the parts
C12 C13 C16-C22 = Cap: Capacitor; Published: 8-Jun-2000; LatestRevisionDate: 17-Jul-2002; LatestRevisionNote: Re-released for DXP Platform.; PackageReference: RAD-0.3; Publisher: Altium Limited; PackageDescription: Radial Cap, Thru-Hole; 2 Leads; 0.3 in Pin Spacing

## Nets that join several sheets
3.3V: mikrokontroler (15 pins), power (A5.3 C11.2), blokadni_kondenzatori (C12.2 C13.2 C16.2 C17.2)
5V: led1 (D5.8), led2 (D1.8 D1.10), led3 (D2.8 D2.9), led4 (D3.8 D3.9 D3.10), led5 (D6.8), mikrokontroler (A4.6 C7.2 R41.1), blokadni_kondenzatori (5 pins)
9V: mikrokontroler (A4.2 C4.2), power (5 pins)
12V: led1 (5 pins), led2 (5 pins), led3 (5 pins), led4 (5 pins), led5 (5 pins)
GND: led1 (8 pins), led2 (7 pins), led3 (7 pins), led4 (6 pins), led5 (8 pins), mikrokontroler (19 pins), power (10 pins), blokadni_kondenzatori (9 pins)
PB6: led1 (D5.6), led2 (D1.6), led3 (D2.6), led4 (D3.6), mikrokontroler (D4.42 R34.1)
PB7: led1 (D5.7), led2 (D1.7), led3 (D2.7), led4 (D3.7), mikrokontroler (D4.43 R33.1)
PB8: led5 (D6.6), mikrokontroler (D4.45 R39.1)
PB9: led5 (D6.7), mikrokontroler (D4.46 R38.1)